# EAGLE design BuckComverter (EAGLE 7.2.0)
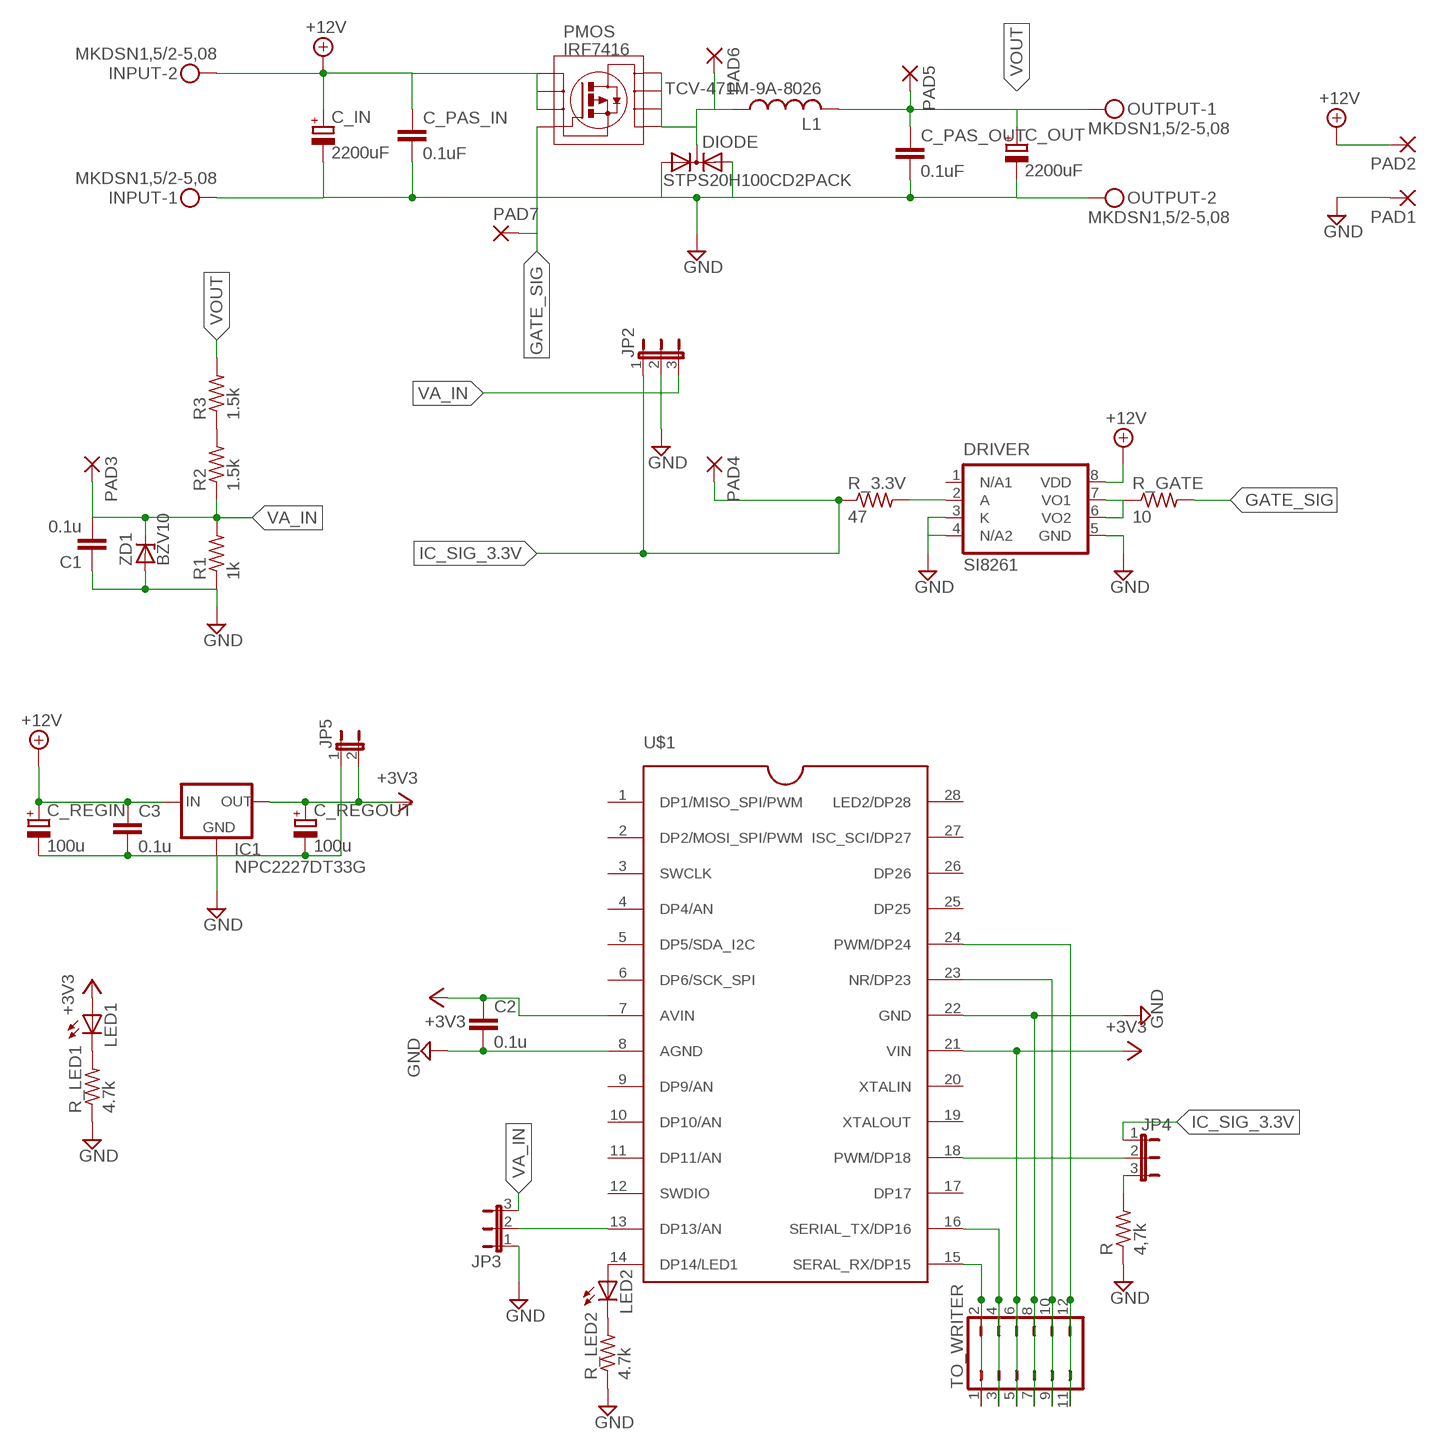
[diagram p0: schematic, sheet 1]

## Parts
C1  0.1u  C-EU025-024X044  [C025-024X044]
C2  0.1u  C-EUC2012  [C2012]
C3  0.1u  C-EU025-024X044  [C025-024X044]
C_IN  2200uF  CPOL-EUE7.5-16  [E7,5-16]
C_OUT  2200uF  CPOL-EUE7.5-16  [E7,5-16]
C_PAS_IN  0.1uF  C-EUC3216  [C3216]
C_PAS_OUT  0.1uF  C-EUC3216  [C3216]
C_REGIN  100u  CPOL-EUE2.5-6  [E2,5-6]
C_REGOUT  100u  CPOL-EUE2.5-6  [E2,5-6]
DIODE  STPS20H100CD2PACK  [D2PACK]
DRIVER  SI8261  [SOP08]
IC1  NPC2227DT33G  [DPACK]
INPUT  MKDSN1,5/2-5,08  [MKDSN1,5/2-5,08]
JP2  JP2E  [JP2]
JP3  JP2E  [JP2]
JP4  JP2E  [JP2]
JP5  JP1E  [JP1]
L1  TCV-471M-9A-8026  [TCV-471M-9A-8026]
LED1  LED3MM  [LED3MM]
LED2  LED3MM  [LED3MM]
OUTPUT  MKDSN1,5/2-5,08  [MKDSN1,5/2-5,08]
PAD1  1,6/0,8  [1,6/0,8]
PAD2  1,6/0,8  [1,6/0,8]
PAD3  1,6/0,8  [1,6/0,8]
PAD4  1,6/0,8  [1,6/0,8]
PAD5  1,6/0,8  [1,6/0,8]
PAD6  1,6/0,8  [1,6/0,8]
PAD7  1,6/0,8  [1,6/0,8]
PMOS  IRF7416  [SOP08]
R  4,7k  R-US_0204/5  [0204/5]
R1  1k  R-US_0207/7  [0207/7]
R2  1.5k  R-US_0207/10  [0207/10]
R3  1.5k  R-US_0207/7  [0207/7]
R_3.3V  47  R-US_0204/7  [0204/7]
R_GATE  10  R-US_M2012  [M2012]
R_LED1  4.7k  R-US_0204/2V  [0204V]
R_LED2  4.7k  R-US_0204/7  [0204/7]
TO_WRITER  JP6Q  [JP6Q]
U$1  LPC1114FDH28  [TSSOP28]
ZD1  BZV10  [DO34Z7]

## Nets
+3V3: C2.1 C_REGOUT.+ IC1.4(OUT) JP5.2 LED1.A TO_WRITER.5 TO_WRITER.6 U$1.7(AVIN) U$1.21(VIN)
+12V: C3.1 C_IN.+ C_PAS_IN.1 C_REGIN.+ DRIVER.8(VDD) IC1.3(IN) INPUT.2 PAD2.1(P) PMOS.1(S1) PMOS.2(S2) PMOS.3(S3)
GATE_SIG: PAD7.1(P) PMOS.4(G) R_GATE.2
GND: C1.1 C2.2 C3.2 C_IN.- C_OUT.- C_PAS_IN.2 C_PAS_OUT.2 C_REGIN.- C_REGOUT.- DIODE.1(A3) DIODE.3(A4) DRIVER.3(K) DRIVER.4(N/A2) DRIVER.5(GND) IC1.1(GND) INPUT.1 JP2.2 JP3.1 JP5.1 OUTPUT.2 PAD1.1(P) R1.1 R.1 R_LED1.1 R_LED2.1 TO_WRITER.7 TO_WRITER.8 U$1.8(AGND) U$1.22(GND) ZD1.A
IC_SIG_3.3V: JP2.1 JP4.1 PAD4.1(P) R_3.3V.1
N$1: LED1.K(C) R_LED1.2
N$2: DRIVER.2(A) R_3.3V.2
N$3: LED2.A U$1.14(DP14/LED1)
N$4: R2.2 R3.1
N$5: DRIVER.6(VO2) DRIVER.7(VO1) R_GATE.1
N$6: JP3.2 U$1.13(DP13/AN)
N$7: JP4.3 R.2
N$8: JP4.2 U$1.18(PWM/DP18)
N$9: TO_WRITER.1 TO_WRITER.2 U$1.15(SERAL_RX/DP15)
N$10: TO_WRITER.3 TO_WRITER.4 U$1.16(SERIAL_TX/DP16)
N$11: TO_WRITER.9 TO_WRITER.10 U$1.23(NR/DP23)
N$12: TO_WRITER.11 TO_WRITER.12 U$1.24(PWM/DP24)
N$13: LED2.K(C) R_LED2.2
N$19: DIODE.2(C) L1.P$1 PAD6.1(P) PMOS.5(D5) PMOS.6(D6) PMOS.7(D7) PMOS.8(D8)
VA_IN: C1.2 JP2.3 JP3.3 PAD3.1(P) R1.2 R2.1 ZD1.C
VOUT: C_OUT.+ C_PAS_OUT.1 L1.P$2 OUTPUT.1 PAD5.1(P) R3.2
Unconnected: DRIVER.1(N/A1) U$1.1(DP1/MISO_SPI/PWM) U$1.2(DP2/MOSI_SPI/PWM) U$1.3(SWCLK) U$1.4(DP4/AN) U$1.5(DP5/SDA_I2C) U$1.6(DP6/SCK_SPI) U$1.9(DP9/AN) U$1.10(DP10/AN) U$1.11(DP11/AN) U$1.12(SWDIO) U$1.17(DP17) U$1.19(XTALOUT) U$1.20(XTALIN) U$1.25(DP25) U$1.26(DP26) U$1.27(ISC_SCI/DP27) U$1.28(LED2/DP28)

## Library data of the parts
C1-C3 C_PAS_IN C_PAS_OUT = rcl:C-EU: CAPACITOR, European symbol
C_IN C_OUT C_REGIN C_REGOUT = rcl:CPOL-EU: POLARIZED CAPACITOR, European symbol
DIODE = power-schottky-rectifier:STPS20H100C: STPS20H100C - Power Schottky Rectifier Description: Dual center tap Schottky rectifier designed for high frequency miniature switch mode power supplies such as adaptors and on0board DCDC converters. Device summary: If(ave): 2x10A Vrrm: 100V Tj(max): 175℃ Vf(typ): 0.59V Source: Datasheet <http://www.st.com/content/ccc/resource/technical/document/datasheet/7e/4a/1d/90/62/65/40/f2/CD00001292.pdf/files/CD00001292.pdf/jcr:content/translations/en.CD00001292.pdf>; MF: STMicroelectronics; MPN: STPS20H100CG-TR; RS-NUMBER: 687-0713
DRIVER = gate-drivers:SI8261: Si8261 - 5kV LED Emulator Input, 4.0 Isolated Gate Drivers Description: The Si826x isolators are pin-compatible, drop-in upgrades for popular opto-coupled gate drivers, such as 0.6A ACPL-0302/3020, 2.5 A HCPL-3120/ACPL-3130,HCNW3120/3130, and similar opto-drivers. Recommended Operating Conditions: Vdd: 5 to 30V If(on): 6 to 30mA Ta: -40 to 125℃ soure : Datasheet <http://jp.rs-online.com/webdocs/1299/0900766b81299254.pdf>; MF: Silicon Laboratories; MPN: Si8261ACA-C-IS; RS-NUMBER: 795-1453
IC1 = v-reg2:NPC2227DT33G
INPUT OUTPUT = con-phoenix-508:MKDSN1,5/2-5,08: MKDSN 1,5/ 2-5,08 Printklemme Nennstrom: 13,5 A Nennspannung: 250 V Rastermaß: 5,08 mm Polzahl: 2 Anschlussart: Schraubanschluss Montage: Löten Anschlussrichtung Leiter/Platine: 0 ° Artikelnummer: 1729128 Source: http://eshop.phoenixcontact.com .. 1729128.pdf
JP2-JP4 = jumper:JP2E: JUMPER
JP5 = jumper:JP1E: JUMPER
L1 = TCV-471M-9A-8026:TCV-471M-9A-8026
LED1 LED2 = led:LED: LED OSRAM: - CHIPLED LG R971, LG N971, LY N971, LG Q971, LY Q971, LO R971, LY R971 LH N974, LH R974 LS Q976, LO Q976, LY Q976 LO Q996 - Hyper CHIPLED LW Q18S LB Q993, LB Q99A, LB R99A - SideLED LS A670, LO A670, LY A670, LG A670, LP A670 LB A673, LV A673, LT A673, LW A673 LH A674 LY A675 LS A676, LA A676, LO A676, LY A676, LW A676 LS A679, LY A679, LG A679 - Hyper Micro SIDELED® LS Y876, LA Y876, LO Y876, LY Y876 LT Y87S - SmartLED LW L88C, LW L88S LB L89C, LB L89S, LG L890 LS L89K, LO L89K, LY L89K LS L896, LA L896, LO L896, LY L896 - TOPLED LS T670, LO T670, LY T670, LG T670, LP T670 LSG T670, LSP T670, LSY T670, LOP T670, LYG T670 LG T671, LOG T671, LSG T671 LB T673, LV T673, LT T673, LW T673 LH T674 LS T676, LA T676, LO T676, LY T676, LB T676, LH T676, LSB T676, LW T676 LB T67C, LV T67C, LT T67C, LS T67K, LO T67K, LY T67K, LW E67C LS E67B, LA E67B, LO E67B, LY E67B, LB E67C, LV E67C, LT E67C LW T67C LS T679, LY T679, LG T679 LS T770, LO T770, LY T770, LG T770, LP T770 LB T773, LV T773, LT T773, LW T773 LH T774 LS E675, LA E675, LY E675, LS T675 LS T776, LA T776, LO T776, LY T776, LB T776 LHGB T686 LT T68C, LB T68C - Hyper Mini TOPLED® LB M676 - Mini TOPLED Santana® LG M470 LS M47K, LO M47K, LY M47K Source: http://www.osram.convergy.de LUXEON: - LUMILED® LXK2-PW12-R00, LXK2-PW12-S00, LXK2-PW14-U00, LXK2-PW14-V00 LXK2-PM12-R00, LXK2-PM12-S00, LXK2-PM14-U00 LXK2-PE12-Q00, LXK2-PE12-R00, LXK2-PE12-S00, LXK2-PE14-T00, LXK2-PE14-U00 LXK2-PB12-K00, LXK2-PB12-L00, LXK2-PB12-M00, LXK2-PB14-N00, LXK2-PB14-P00, LXK2-PB14-Q00 LXK2-PR12-L00, LXK2-PR12-M00, LXK2-PR14-Q00, LXK2-PR14-R00 LXK2-PD12-Q00, LXK2-PD12-R00, LXK2-PD12-S00 LXK2-PH12-R00, LXK2-PH12-S00 LXK2-PL12-P00, LXK2-PL12-Q00, LXK2-PL12-R00 Source: www.luxeon.com KINGBRIGHT: KA-3528ASYC Source: www.kingbright.com
PAD1-PAD7 = wirepad:1,6/0,8: THROUGH-HOLE PAD
PMOS = pMOS-FET:IRF7416
R R1-R3 R_3.3V R_GATE R_LED1 R_LED2 = rcl:R-US_: RESISTOR, American symbol
TO_WRITER = jumper:JP6Q: JUMPER
U$1 = lpc1114fn28:LPC1114FDH28
ZD1 = diode:BZV10: Z DIODE

## Board
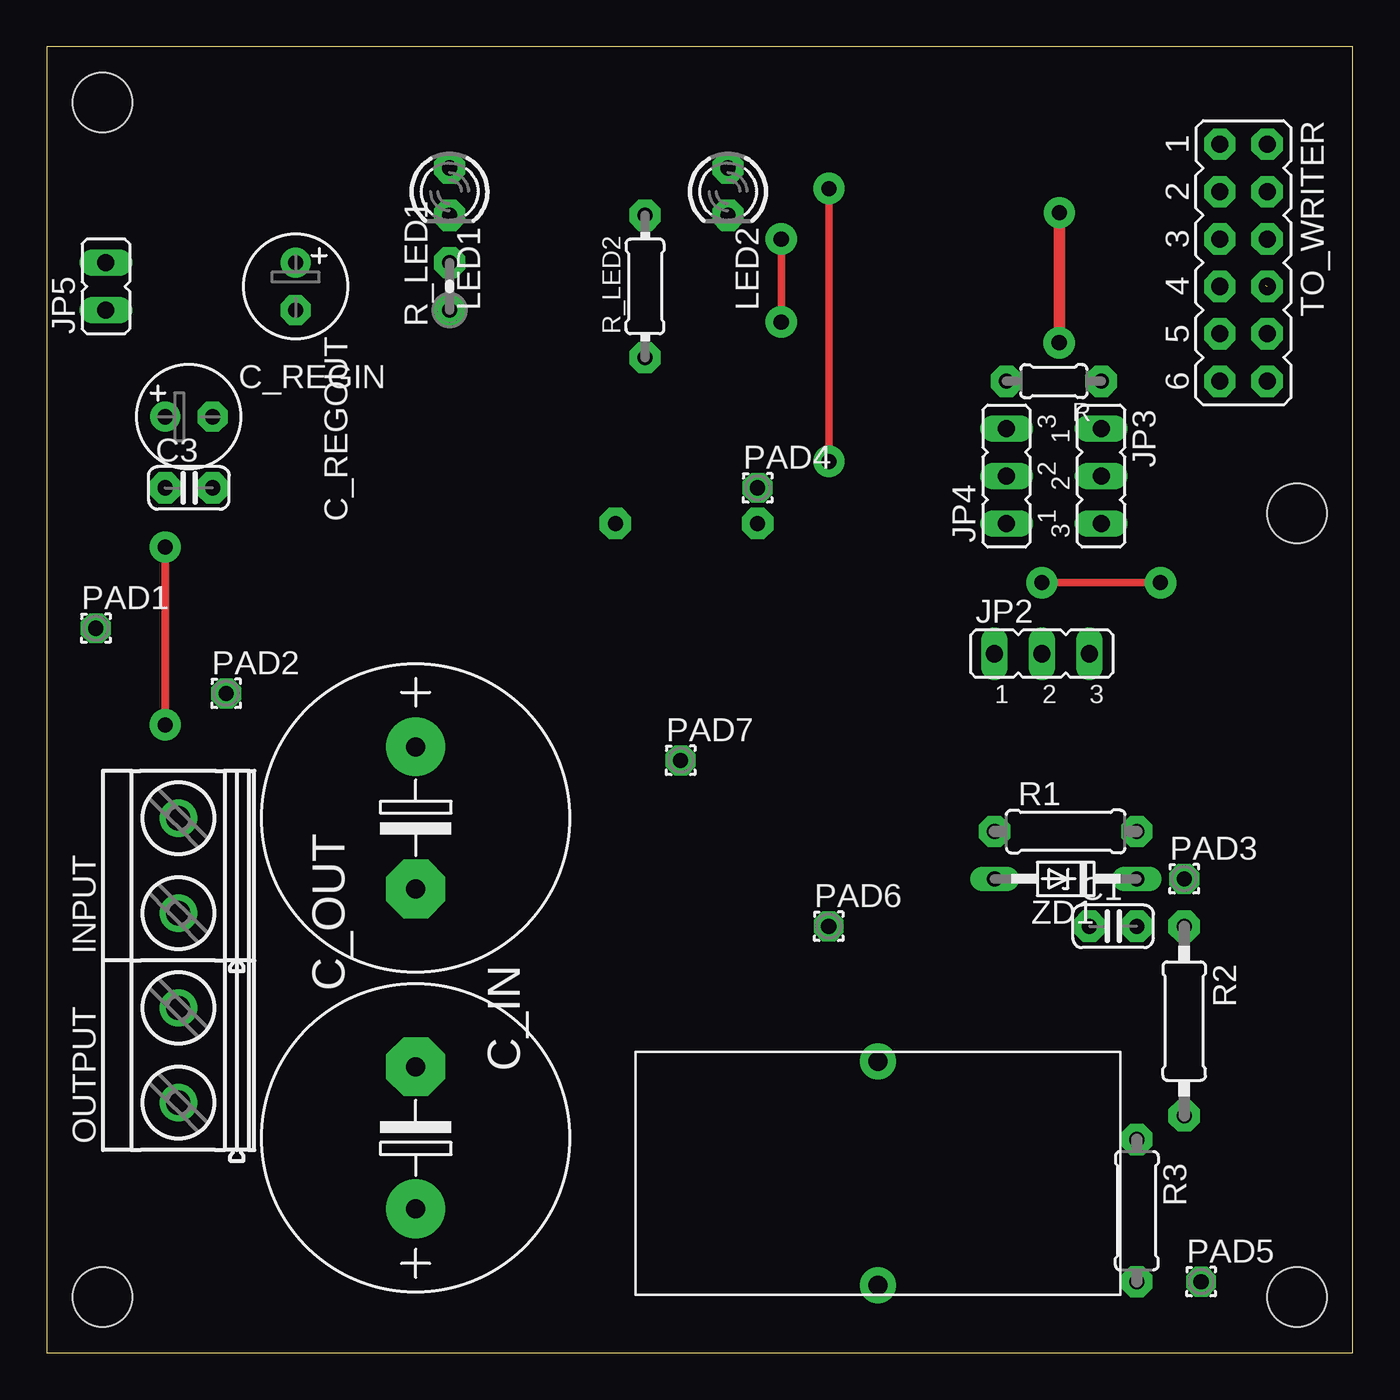
[diagram p1: board, top side]
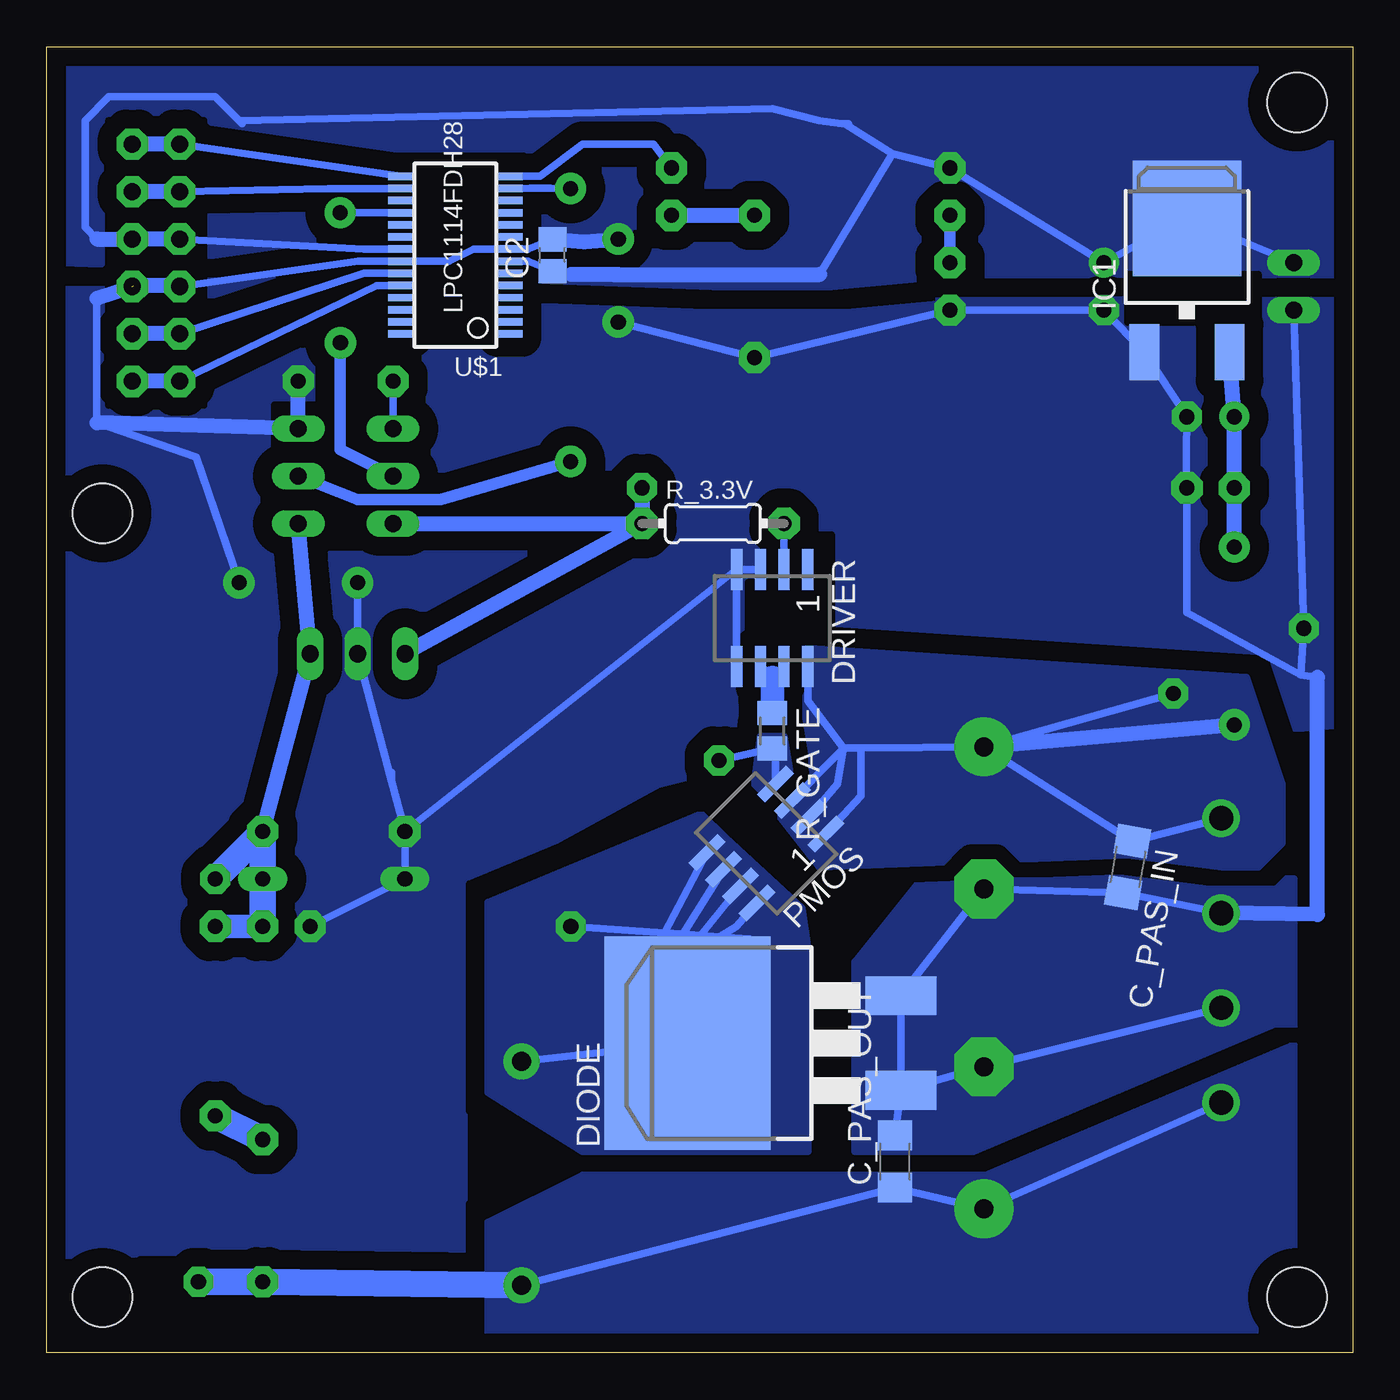
[diagram p2: board, bottom side, seen from below]

Size 70 x 70 mm. Coordinates in mm from the lower left corner, seen from the top.
Outline: 0,0 70,0 70,70 0,70 0,0
Copper layers (1*16): Top 0.035mm / dielectric 1.5mm / Bottom 0.035mm
Design rules "default": minimum track width 10mil, minimum drill 24mil, track to track 8mil, track to pad 8mil, pad to pad 8mil, via to via 8mil, smd to smd 8mil, copper to edge 40mil, drill to drill 8mil, minimum pad ring 10mil, minimum via ring 8mil, stop-mask expansion 4mil, vias tented up to drill 0mil, thermal gap 10mil
Holes 3.2 mm at 3,3 67,3 67,45 3,67

### Footprints (pad centres in the part's own frame; a part is rotated, then mirrored left to right if it is on the bottom)
C025-024X044 = drill 0.813 pad 1.676 octagon: 1 -1.27,0; 2 1.27,0
C2012 = smd 1.3 x 1.5: 1 -0.85,0; 2 0.85,0
E7,5-16 = drill 1.016 pad 3.15: + -3.81,0 | drill 1.016 pad 3.15 octagon: - 3.81,0
C3216 = smd 1.6 x 1.8: 1 -1.4,0; 2 1.4,0
E2,5-6 = drill 0.813 pad 1.6: + -1.27,0 | drill 0.813 pad 1.6 octagon: - 1.27,0
D2PACK = smd 2.083 x 3.81: 1 -2.54,-8.89; 3 2.54,-8.89 | smd 11.43 x 8.89: 2 0,2.54
SOP08 = smd 0.6 x 2.2: 1 -1.905,-2.6; 2 -0.635,-2.6; 3 0.635,-2.6; 4 1.905,-2.6; 5 1.905,2.6; 6 0.635,2.6; 7 -0.635,2.6; 8 -1.905,2.6
DPACK = smd 1.6 x 3: 1 -2.28,-4.8; 3 2.28,-4.8 | smd 5.8 x 6.2: 4 0,2.38
MKDSN1,5/2-5,08 = drill 1.3 pad 2: 1 -2.561,0.025; 2 2.519,0.025
JP2 = drill 0.914 long: 1 -2.54,0; 2 0,0; 3 2.54,0
JP1 = drill 0.914 long: 1 0,-1.27; 2 0,1.27
TCV-471M-9A-8026 = drill 1 pad 1.93: P$1 -6,0; P$2 6,0
LED3MM = drill 0.813 pad 1.676 octagon: A -1.27,0; K 1.27,0
1,6/0,8 = drill 0.813 pad 1.6 octagon: 1 0,0
0204/5 = drill 0.813 pad 1.676 octagon: 1 -2.54,0; 2 2.54,0
0207/7 = drill 0.813 pad 1.676 octagon: 1 -3.81,0; 2 3.81,0
0207/10 = drill 0.813 pad 1.676 octagon: 1 -5.08,0; 2 5.08,0
0204/7 = drill 0.813 pad 1.676 octagon: 1 -3.81,0; 2 3.81,0
M2012 = smd 1.3 x 1.6: 1 -0.95,0; 2 0.95,0
0204V = drill 0.813 pad 1.676 octagon: 1 -1.27,0; 2 1.27,0
JP6Q = drill 0.914 pad 1.676 octagon: 1 -6.35,-1.27; 2 -6.35,1.27; 3 -3.81,-1.27; 4 -3.81,1.27; 5 -1.27,-1.27; 6 -1.27,1.27; 7 1.27,-1.27; 8 1.27,1.27; 9 3.81,-1.27; 10 3.81,1.27; 11 6.35,-1.27; 12 6.35,1.27
TSSOP28 = smd 0.4 x 1.35: 1 -4.225,-2.925; 2 -3.575,-2.925; 3 -2.925,-2.925; 4 -2.275,-2.925; 5 -1.625,-2.925; 6 -0.975,-2.925; 7 -0.325,-2.925; 8 0.325,-2.925; 9 0.975,-2.925; 10 1.625,-2.925; 11 2.275,-2.925; 12 2.925,-2.925; 13 3.575,-2.925; 14 4.225,-2.925; 15 4.225,2.925; 16 3.575,2.925; 17 2.925,2.925; 18 2.275,2.925; 19 1.625,2.925; 20 0.975,2.925; 21 0.325,2.925; 22 -0.325,2.925; 23 -0.975,2.925; 24 -1.625,2.925; 25 -2.275,2.925; 26 -2.925,2.925; 27 -3.575,2.925; 28 -4.225,2.925
DO34Z7 = drill 0.813 long: A 3.81,0; C -3.81,0

### Placement (x,y rotation side)
C1  57.15,22.86 0 top
C2  42.9,58.83 90 bottom
C3  7.62,46.35 0 top
C_IN  19.78,28.67 270 top
C_OUT  19.78,11.53 90 top
C_PAS_IN  12.06,26.04 260 bottom
C_PAS_OUT  24.54,10.26 90 bottom
C_REGIN  7.62,50.16 0 top
C_REGOUT  13.34,57.15 270 top
DIODE  33.12,16.61 90 bottom
DRIVER  31.11,39.37 180 bottom
IC1  8.89,58.42 0 bottom
INPUT  7.08,26.13 90 top
JP2  53.34,37.47 0 top
JP3  56.52,46.99 270 top
JP4  51.44,46.99 90 top
JP5  3.17,57.15 0 top
L1  44.55,9.62 270 top
LED1  21.59,62.23 270 top
LED2  36.51,62.23 270 top
OUTPUT  7.08,15.97 90 top
PAD1  2.63,38.83 0 top
PAD2  9.62,35.34 0 top
PAD3  60.96,25.4 0 top
PAD4  38.1,46.35 0 top
PAD5  61.87,3.81 0 top
PAD6  41.91,22.86 0 top
PAD7  33.97,31.75 0 top
PMOS  31.43,27.3 135 bottom
R  53.98,52.07 180 top
R1  54.61,27.94 0 top
R2  60.96,17.78 270 top
R3  58.42,7.62 270 top
R_3.3V  34.29,44.45 0 bottom
R_GATE  31.11,33.34 270 bottom
R_LED1  21.59,57.15 90 top
R_LED2  32.07,57.15 90 top
TO_WRITER  64.14,58.42 270 top
U$1  48.1,58.83 90 bottom
ZD1  54.61,25.4 180 top

### Tracks (layer width: path | path; a pad name or v marks a point on that pad's centre or on a via)
+3V3
  Bottom 0.406: 27.04,65.88 27.3,65.88 27.18,65.84 | U$1.21 52.98,59.15 TO_WRITER.5 | 59.53,65.88 59.69,66.04 | 59.69,66.04 60.96,67.31 66.67,67.31 67.94,66.04 67.94,60.33 67.31,59.69 | 24.68,64.27 LED1.A C_REGOUT.+ IC1.4 JP5.2 | 24.68,64.27 27.18,65.84 | 27.18,65.84 28.57,66.04 31.11,66.67 59.69,66.04 | 28.57,57.78 24.68,64.27 | U$1.7 44.2,58.5 C2.1 41.88,57.78
  Bottom 0.813: TO_WRITER.5 TO_WRITER.6 67.31,59.69 | 39.37,57.78 39.65,57.78 | 39.65,57.78 41.88,57.78 | 39.65,57.78 28.57,57.78
  pour Bottom (isolate 1.016, no thermals): 0.64,57.78 0.64,69.85 69.22,69.85 69.22,58.42 34.29,57.15 27.94,57.15 20.95,57.78
+12V  (via drill 0.8 pad 1.68)
  Top 0.406: v6.35,43.18 v6.35,33.66
  Bottom 0.406: INPUT.2 C_PAS_IN.1 C_IN.+ | PAD2.1 C_IN.+ | 27.31,32.4 27.31,32.39 28.57,31.11 PMOS.3 | 27.31,32.4 26.68,32.41 26.36,32.41 | 26.36,32.41 C_IN.+ | PMOS.2 27.62,30.48 27.31,32.4 | PMOS.1 26.35,29.84 26.36,32.41 | DRIVER.8 29.21,34.92 27.31,32.4
  Bottom 0.813: IC1.3 C_REGIN.+ C3.1 v6.35,43.18 | v6.35,33.66 C_IN.+
  pour Bottom (isolate 0.813, rank 5, no thermals): 6.99,26.04 12.06,26.67 28.57,26.04 30.8,28.89 29.53,37.78 5.71,36.2 3.81,30.48 3.81,27.3 5.08,26.04
GATE_SIG
  Bottom 0.406: PAD7.1 R_GATE.2 30.57,32.48 30.94,32.48 PMOS.4
  pour Bottom (no thermals): 30.16,31.11 31.43,29.84 32.07,30.48 31.75,33.02 30.48,33.02
GND  (via drill 0.8 pad 1.68, 0.81 pad 1.68)  (1 unrouted)
  Top 0.406: v59.69,41.27 v53.34,41.27 | v39.37,59.69 v39.37,55.24
  Bottom 0.406: INPUT.1 C_PAS_IN.2 C_IN.- DIODE.3 DIODE.1 | DIODE.1 C_OUT.- OUTPUT.2 | DIODE.1 C_PAS_OUT.2 | 51.52,30.63 JP2.2 v53.34,41.27 | 51.52,30.63 R1.1 | R1.1 ZD1.A C1.1 | 67.31,56.52 67.31,49.85 62,48 v59.69,41.27 | 51.52,31.11 51.52,30.63 | DRIVER.4 R1.1 | DRIVER.3 DRIVER.4 | DRIVER.5 DRIVER.4 | 1.91,36.2 2.8,36.33 | 2.8,36.33 8.89,39.69 C3.2 8.94,48.1 C_REGIN.- IC1.1 C_REGOUT.- R_LED1.1 R_LED2.1 v39.37,55.24 | 2.8,36.33 PAD1.1 JP5.1 | C2.2 44.2,59.15 U$1.8 47.12,59.15 48.42,58.5 U$1.22 53.3,58.5 TO_WRITER.7
  Bottom 0.813: 67.31,56.52 TO_WRITER.8 | 67.31,49.85 JP3.1 R.1 | INPUT.1 1.91,23.5 1.91,36.2 | C2.2 41.2,59.54 v39.37,59.69 | 63.05,57.2 65.33,57.2
  pour Bottom (isolate 0.813, rank 6, no thermals): 3.17,25.4 11.43,25.4 21.59,27.3 26.67,20.95 26.67,10.79 19.68,10.79 3.17,17.14
  pour Bottom (isolate 1.016, rank 6, no thermals): 0.64,69.22 0.64,33.66 35.88,30.8 37.15,30.48 47.62,24.77 47.62,0.64 69.85,0.64 69.85,70.48
IC_SIG_3.3V
  Bottom 0.813: PAD4.1 R_3.3V.1 | JP4.1 R_3.3V.1 | R_3.3V.1 JP2.1
N$1
  Bottom 0.61: LED1.K R_LED1.2
N$2
  Bottom 0.406: R_3.3V.2 DRIVER.2
N$3
  Bottom 0.406: U$1.14 43.55,63.05 41.27,64.77 37.47,64.77 LED2.A
N$4
  Bottom 1.422: R2.2 R3.1
N$5
  Bottom 0.406: DRIVER.7 31.11,36.2 31.75,36.83 DRIVER.6
  Bottom 1.27: R_GATE.1 31.11,36.2
N$6  (via drill 0.8 pad 1.68)
  Top 0.406: v41.92,62.4 v41.92,47.77
  Bottom 0.406: U$1.13 arc1 v41.92,62.4
  Bottom 0.61: v41.92,47.77 48.9,45.72 53.34,45.72 JP3.2
N$7
  Bottom 0.406: R.2 JP4.3
N$8  (via drill 0.81 pad 1.68)
  Top 0.61: v54.26,54.13 v54.27,61.1
  Bottom 0.406: v54.27,61.1 U$1.18
  Bottom 0.61: JP4.2 54.26,48.42 v54.26,54.13
N$9
  Bottom 0.406: U$1.15 TO_WRITER.1
  Bottom 0.813: TO_WRITER.1 TO_WRITER.2
N$10
  Bottom 0.406: U$1.16 54.92,62.4 TO_WRITER.3
  Bottom 0.813: TO_WRITER.3 TO_WRITER.4
N$11
  Bottom 0.406: U$1.23 52.98,57.85 TO_WRITER.9
  Bottom 0.813: TO_WRITER.9 TO_WRITER.10
N$12
  Bottom 0.406: U$1.24 52.33,57.2 TO_WRITER.11
  Bottom 0.813: TO_WRITER.11 TO_WRITER.12
N$13
  Bottom 0.813: LED2.K R_LED2.2
N$15
  cutout Bottom: 44.45,64.14 44.45,53.98 51.44,53.98 51.44,64.14
N$16
  cutout Bottom: 61.59,66.04 61.59,50.8 66.67,50.8 66.67,66.04
N$17
  cutout Bottom: 50.16,50.8 50.16,43.18 57.78,43.18 57.78,50.8
N$18
  cutout Bottom: 27.94,43.18 27.94,38.73 32.38,38.73 32.38,41.27 31.11,41.27 31.11,43.81 27.94,43.81
N$19
  Bottom 0.406: L1.P$1 DIODE.2 32.32,22.19 33.95,22.3 | PAD6.1 36.88,22.51 | 36.88,22.51 35.88,22.44 | 35.88,22.44 34.96,22.37 | 34.96,22.37 33.95,22.3 | PMOS.8 33.02,22.86 33.95,22.3 | PMOS.7 34.96,22.37 | PMOS.6 35.88,22.44 | PMOS.5 36.88,22.51
  pour Bottom (rank 4, no thermals): 33.66,27.62 29.53,23.81 29.21,21.59 29.21,10.79 41.27,10.79 46.35,13.97 46.35,24.13 34.92,28.89
N$20
  cutout Bottom: 47.63,5 47.63,1 65,1 65,5
N$22
  cutout Bottom: 5.08,57.78 5.08,55.24 12.06,55.24 12.06,57.78
VA_IN
  Bottom 0.813: JP3.3 JP2.3 R1.2
  Bottom 1.27: R2.1 C1.2
  Bottom 1.422: C1.2 ZD1.C R1.2 PAD3.1
VOUT
  Bottom 0.406: OUTPUT.1 C_OUT.+ C_PAS_OUT.1 L1.P$2
  Bottom 1.422: L1.P$2 R3.2 PAD5.1
  pour Bottom (isolate 0.813, rank 5, no thermals): 3.17,16.51 3.17,0.64 46.35,0.64 46.35,6.99 41.27,9.53 19.68,9.53